# EAGLE design LimitSwitchInterface (EAGLE 7.5.0)
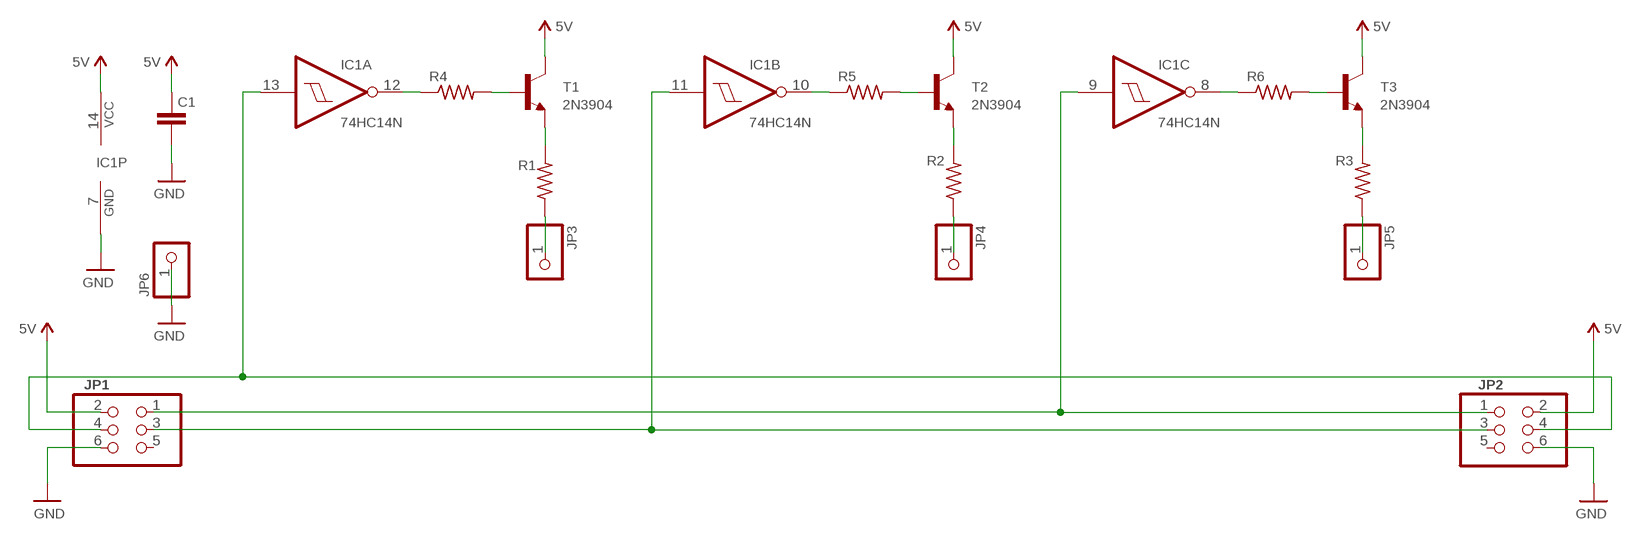
[diagram p0: schematic, sheet 1]

## Parts
C1  C-UNPOL  [CAP-PTH-SMALL2]
IC1  74HC14N  [DIL14]
JP1  PINHD-2X3  [2X03]
JP2  PINHD-2X3  [2X03]
JP3  PINHD-1X1CB  [1X01-CLEANBIG]
JP4  PINHD-1X1CB  [1X01-CLEANBIG]
JP5  PINHD-1X1CB  [1X01-CLEANBIG]
JP6  PINHD-1X1CB  [1X01-CLEANBIG]
R1  RESISTOR-0207/V  [RESISTOR-0207/2V]
R2  RESISTOR-0207/V  [RESISTOR-0207/2V]
R3  RESISTOR-0207/V  [RESISTOR-0207/2V]
R4  RESISTOR-0207/V  [RESISTOR-0207/2V]
R5  RESISTOR-0207/V  [RESISTOR-0207/2V]
R6  RESISTOR-0207/V  [RESISTOR-0207/2V]
T1  2N3904  [2N3904]
T2  2N3904  [2N3904]
T3  2N3904  [2N3904]

## Nets
5V: C1.1 IC1.14(P:VCC) JP1.2 JP2.2 T1.3(C) T2.3(C) T3.3(C)
GND: C1.2 IC1.7(P:GND) JP1.6 JP2.6 JP6.1
N$1: IC1.11(B:I) JP1.3 JP2.3
N$2: IC1.9(C:I) JP1.1 JP2.1
N$3: IC1.12(A:O) R4.1
N$4: IC1.13(A:I) JP1.4 JP2.4
N$5: IC1.10(B:O) R5.1
N$6: IC1.8(C:O) R6.1
N$7: JP3.1 R1.1
N$8: JP4.1 R2.1
N$9: JP5.1 R3.1
N$10: R4.2 T1.2(B)
N$11: R5.2 T2.2(B)
N$12: R2.2 T2.1(E)
N$13: R6.2 T3.2(B)
N$14: R3.2 T3.1(E)
N$15: R1.2 T1.1(E)
Unconnected: IC1.1(D:I) IC1.2(D:O) IC1.3(E:I) IC1.4(E:O) IC1.5(F:I) IC1.6(F:O) JP1.5 JP2.5

## Library data of the parts
C1 = AU2016:C-UNPOL
IC1 = AU2016:74*14: Hex schmitt trigger INVERTER
JP1 JP2 = AU2016:PINHD-2X3: PIN HEADER
JP3-JP6 = AU2016:PINHD-1X1: Pin header 1x1 for 0.1" spacing With round pins
R1-R6 = AU2016:RESISTOR-0207/V
T1-T3 = AU2016:2N3904: NPN TRANSISTOR

## Board
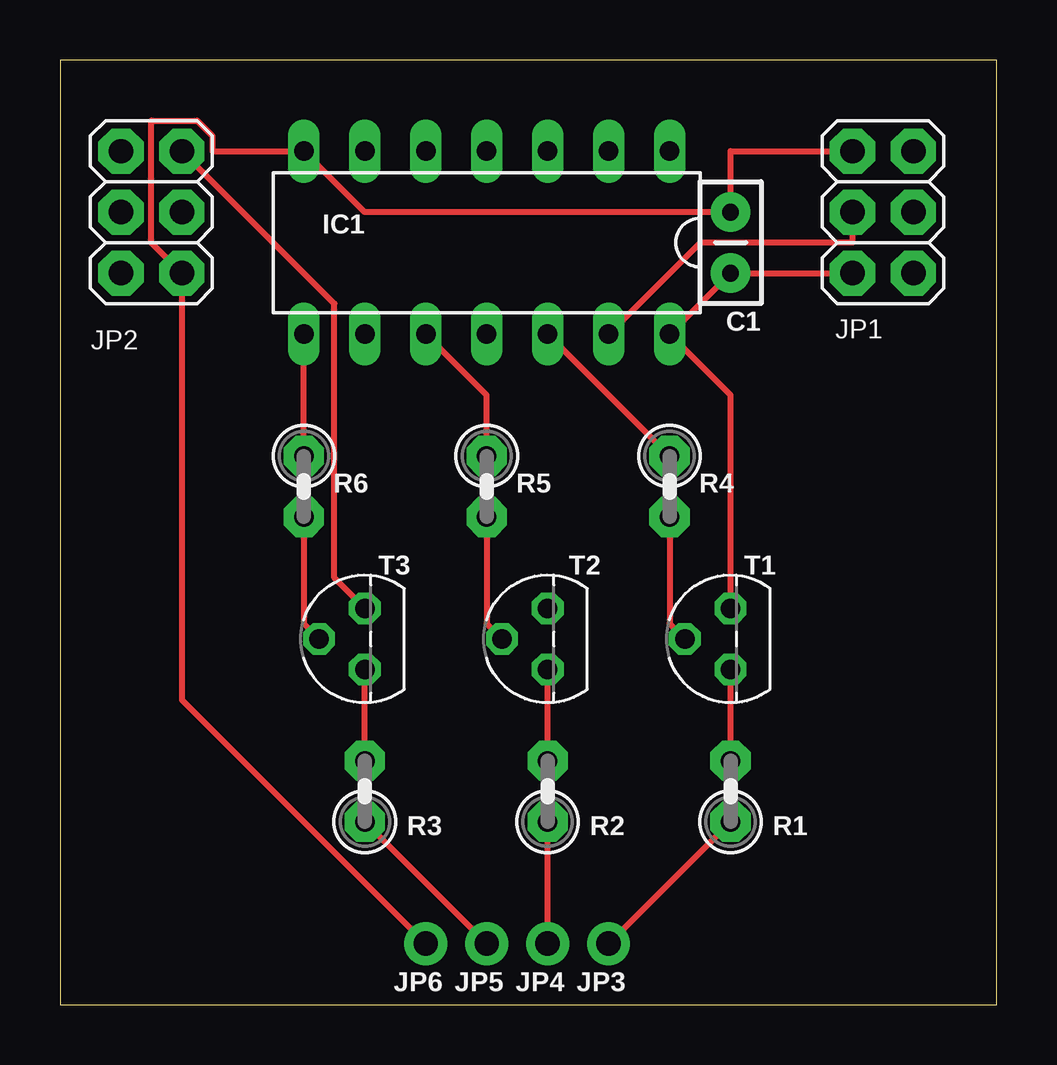
[diagram p1: board, top side]
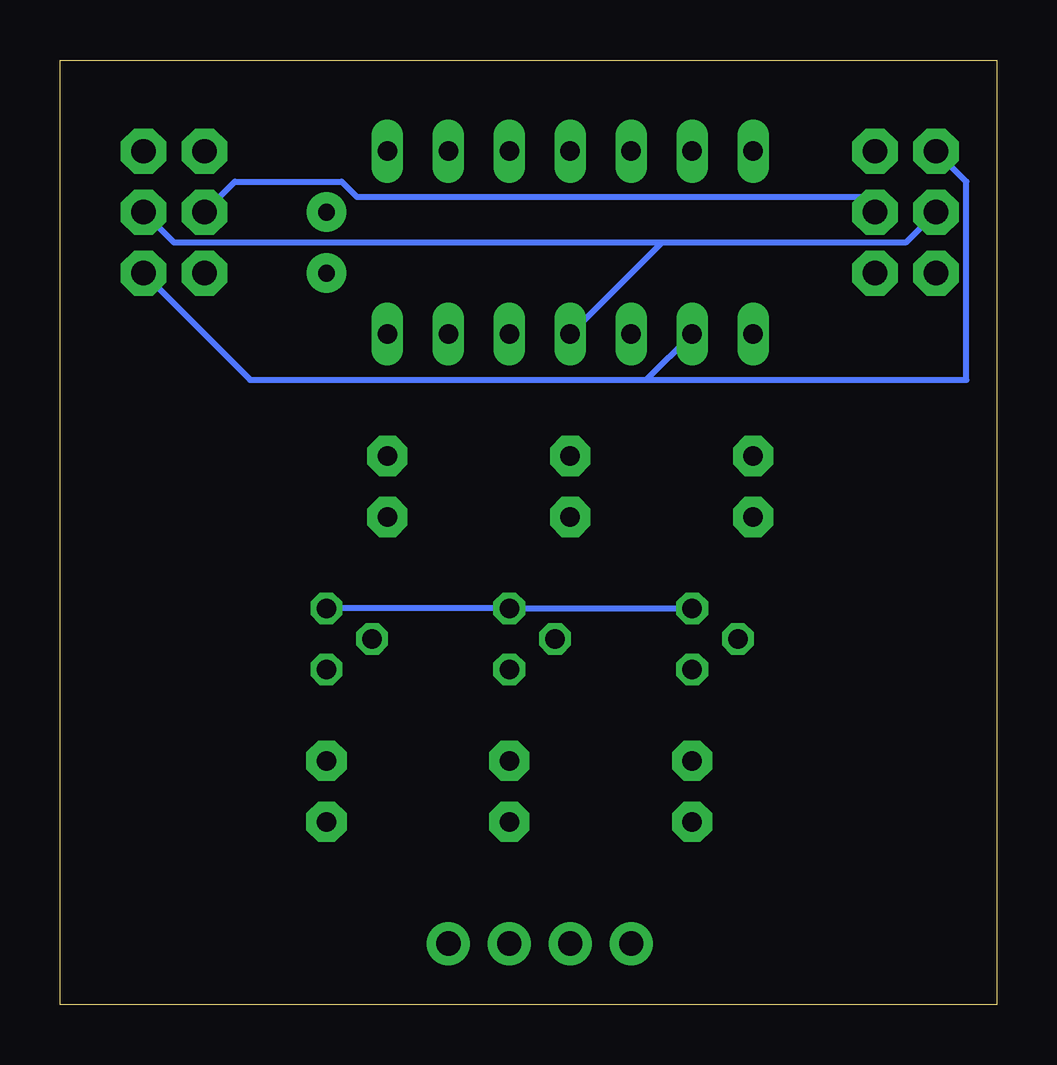
[diagram p2: board, bottom side, seen from below]

Size 39.04 x 39.36 mm. Coordinates in mm from the lower left corner, seen from the top.
Outline: 0,0 39.04,0 39.04,39.36 0,39.36 0,0
Copper layers (1*16): Top 0.035mm / dielectric 1.5mm / Bottom 0.035mm
Design rules "default": minimum track width 10mil, minimum drill 24mil, track to track 8mil, track to pad 8mil, pad to pad 8mil, via to via 8mil, smd to smd 8mil, copper to edge 40mil, drill to drill 8mil, minimum pad ring 10mil, minimum via ring 8mil, stop-mask expansion 4mil, vias tented up to drill 0mil, thermal gap 10mil

### Footprints (pad centres in the part's own frame; a part is rotated, then mirrored left to right if it is on the bottom)
CAP-PTH-SMALL2 = drill 0.7 pad 1.651: 1 0,0; 2 2.54,0
DIL14 = drill 0.813 long: 1 -7.62,-3.81; 2 -5.08,-3.81; 3 -2.54,-3.81; 4 0,-3.81; 5 2.54,-3.81; 6 5.08,-3.81; 7 7.62,-3.81; 8 7.62,3.81; 9 5.08,3.81; 10 2.54,3.81; 11 0,3.81; 12 -2.54,3.81; 13 -5.08,3.81; 14 -7.62,3.81
2X03 = drill 1.016 pad 1.88 octagon: 1 -2.54,-1.27; 2 -2.54,1.27; 3 0,-1.27; 4 0,1.27; 5 2.54,-1.27; 6 2.54,1.27
1X01-CLEANBIG = drill 1.016 pad 1.778: 1 0,0
RESISTOR-0207/2V = drill 0.813 pad 1.676 octagon: 1 -1.27,0; 2 1.27,0
2N3904 = drill 0.813 octagon: 1 -1.27,0; 2 0,1.905; 3 1.27,0

### Placement (x,y rotation side)
C1  27.94,30.48 90 top
IC1  17.78,31.75 180 top
JP1  34.29,33.02 90 top
JP2  3.81,33.02 270 top
JP3  22.86,2.54 0 top
JP4  20.32,2.54 0 top
JP5  17.78,2.54 0 top
JP6  15.24,2.54 0 top
R1  27.94,8.89 90 top
R2  20.32,8.89 90 top
R3  12.7,8.89 90 top
R4  25.4,21.59 270 top
R5  17.78,21.59 270 top
R6  10.16,21.59 270 top
T1  27.94,15.24 90 top
T2  20.32,15.24 90 top
T3  12.7,15.24 90 top

### Tracks (layer width: path | path; a pad name or v marks a point on that pad's centre or on a via)
5V
  Top 0.254: JP1.2 C1.1 IC1.14 27.94,25.4 T1.3 | JP2.2 11.43,29.21 11.43,17.78 T3.3
  Bottom 0.254: T3.3 T2.3 T1.3
GND
  Top 0.254: JP1.6 27.94,35.56 C1.2 12.7,33.02 IC1.7 6.35,35.56 6.35,36.2 5.71,36.83 3.81,36.83 3.81,31.75 JP2.6 5.08,12.7 JP6.1
N$1
  Bottom 0.254: 13.97,31.75 IC1.11 | 13.97,31.75 3.81,31.75 JP2.3 | JP1.3 34.29,31.75 13.97,31.75
N$2
  Bottom 0.254: 14.61,26.04 IC1.9 | 14.61,26.04 31.11,26.04 JP1.1 | JP2.1 1.27,34.29 1.27,26.04 14.61,26.04
N$3
  Top 0.254: R4.1 IC1.12
N$4
  Top 0.254: IC1.13 26.67,31.75 33.02,31.75 JP1.4
  Bottom 0.254: JP2.4 5.71,33.66 26.67,33.66 27.3,34.29 31.75,34.29 JP1.4
N$5
  Top 0.254: IC1.10 17.78,25.4 R5.1
N$6
  Top 0.254: R6.1 IC1.8
N$7
  Top 0.254: JP3.1 R1.1
N$8
  Top 0.254: JP4.1 R2.1
N$9
  Top 0.254: JP5.1 R3.1
N$10
  Top 0.254: T1.2 25.4,15.88 R4.2
N$11
  Top 0.254: T2.2 17.78,15.88 R5.2
N$12
  Top 0.254: R2.2 T2.1
N$13
  Top 0.254: T3.2 10.16,15.88 R6.2
N$14
  Top 0.254: R3.2 T3.1
N$15
  Top 0.254: R1.2 T1.1